# EAGLE design control (EAGLE 9.6.1)
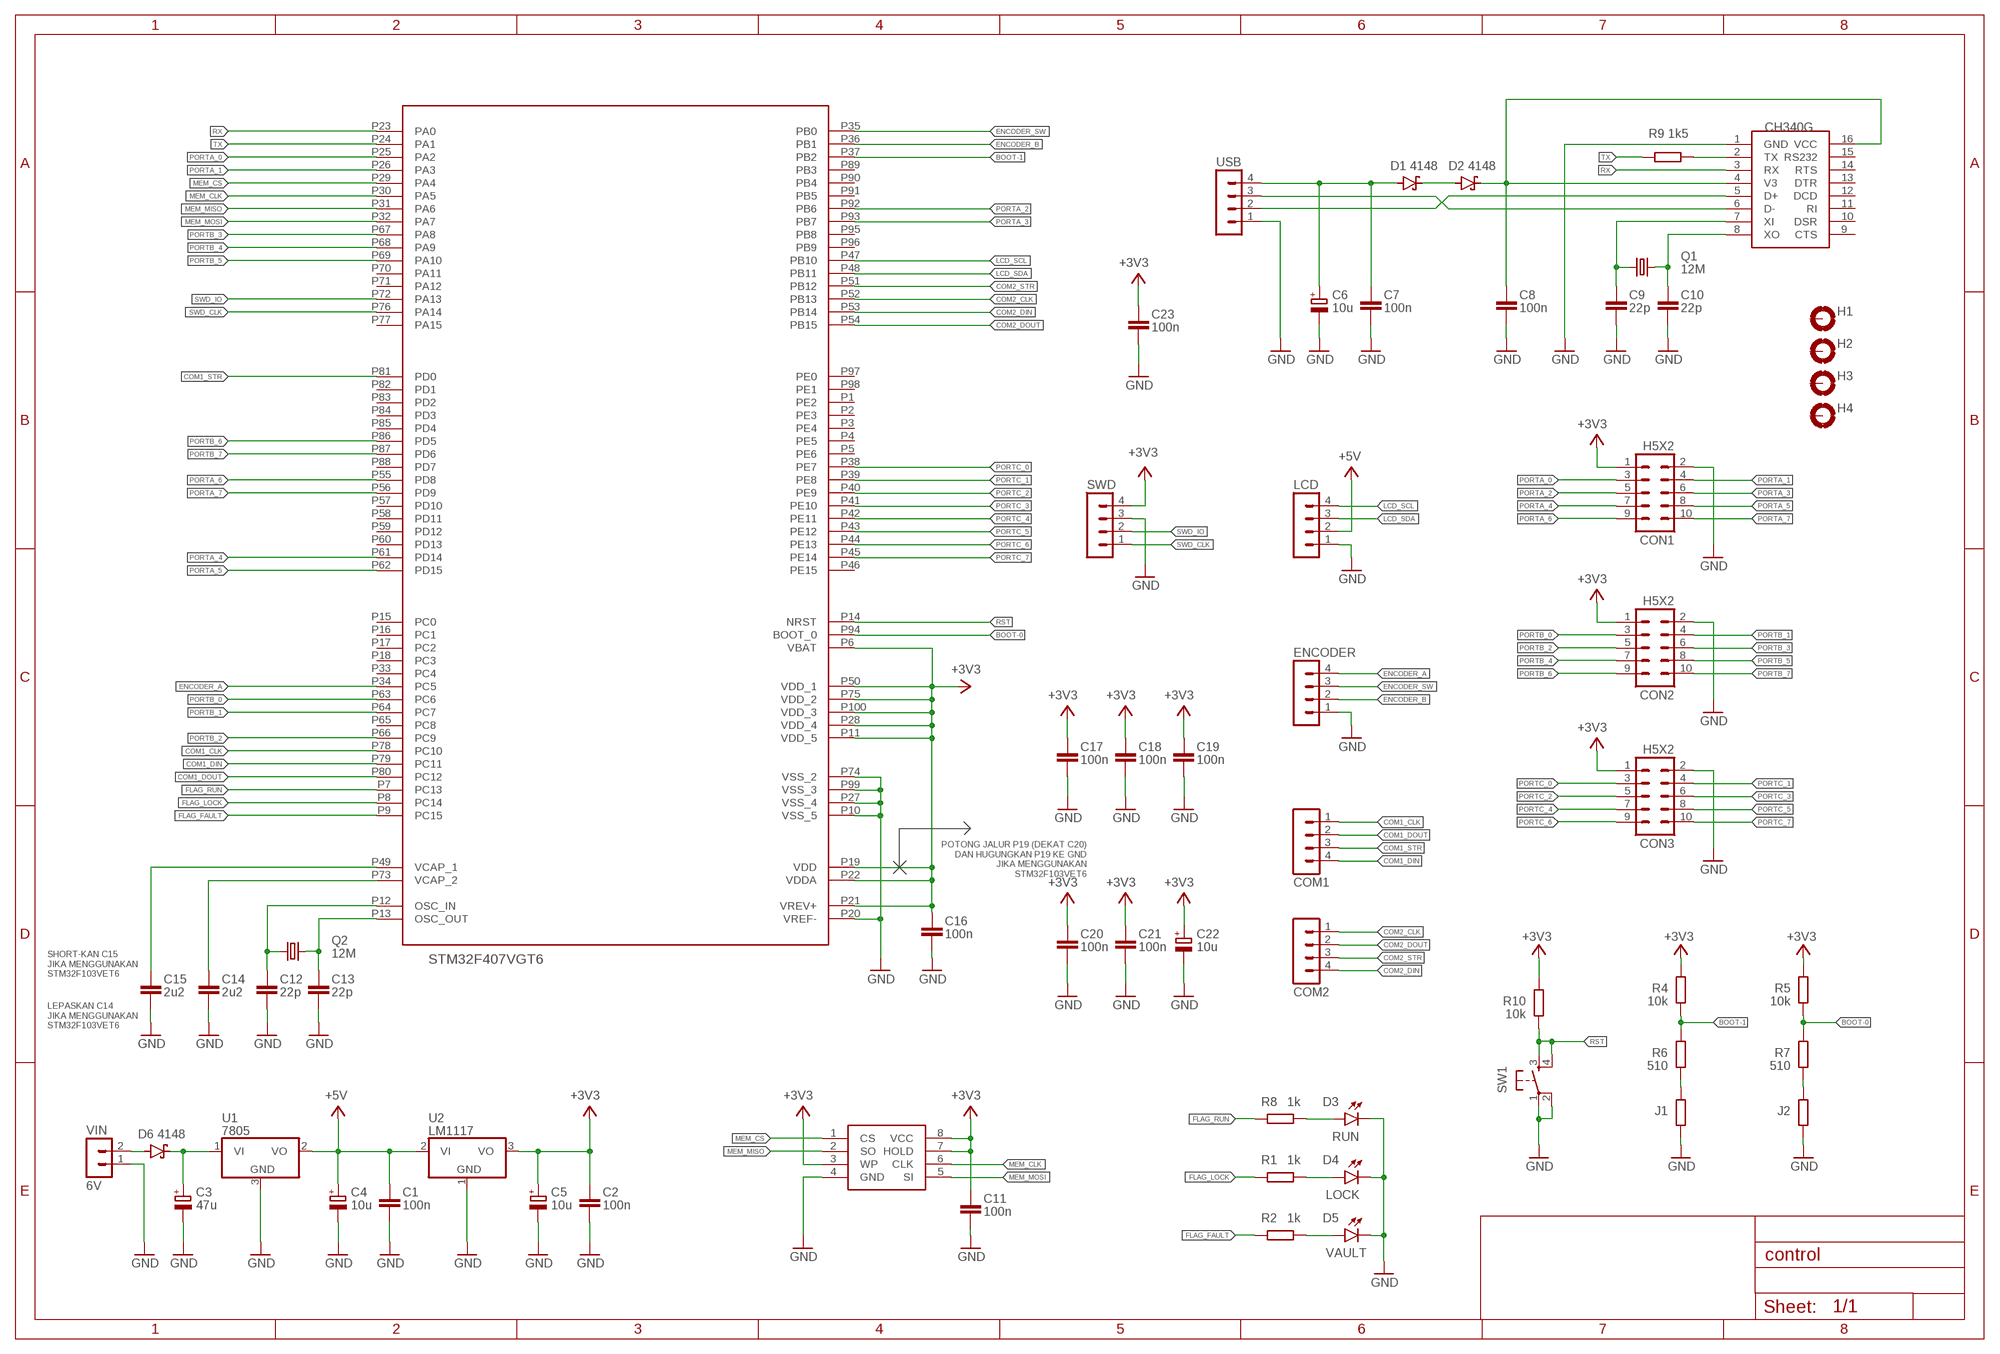
[diagram p0: schematic, sheet 1]

## Parts
C1  100n  CAP  [0805]
C2  100n  CAP  [0805]
C3  47u  C10UF  [E2,5-5]
C4  10u  C10UF  [E2,5-5]
C5  10u  C10UF  [E2,5-5]
C6  10u  C10UF  [E2,5-5]
C7  100n  CAP  [0805]
C8  100n  CAP  [0805]
C9  22p  CAP  [0805]
C10  22p  CAP  [0805]
C11  100n  CAP  [0805]
C12  22p  CAP  [0805]
C13  22p  CAP  [0805]
C14  2u2  CAP  [0805]
C15  2u2  CAP  [0805]
C16  100n  CAP  [0805]
C17  100n  CAP  [0805]
C18  100n  CAP  [0805]
C19  100n  CAP  [0805]
C20  100n  CAP  [0805]
C21  100n  CAP  [0805]
C22  10u  C10UF  [E2,5-5]
C23  100n  CAP  [0805]
COM1  MOLEX-4  [6410-04]
COM2  MOLEX-4  [6410-04]
CON1  H5X2  [MA05-2]
CON2  H5X2  [MA05-2]
CON3  H5X2  [MA05-2]
D1  4148  1N5817  [DO35Z7]
D2  4148  1N5817  [DO35Z7]
D3  RUN  LED3MM  [LED3MM]
D4  LOCK  LED3MM  [LED3MM]
D5  VAULT  LED3MM  [LED3MM]
D6  4148  1N5817  [DO35Z7]
ENCODER  MOLEX-4  [6410-04]
H1  MOUNT-PAD-ROUND3.0  [3,0-PAD]
H2  MOUNT-PAD-ROUND3.0  [3,0-PAD]
H3  MOUNT-PAD-ROUND3.0  [3,0-PAD]
H4  MOUNT-PAD-ROUND3.0  [3,0-PAD]
J1  10k  RES  [0805]
J2  10k  RES  [0805]
LCD  MOLEX-4  [6410-04]
Q1  12M  CRYSTAL  [HC49/S]
Q2  12M  CRYSTAL  [HC49/S]
R1  1k  RES  [0805]
R2  1k  RES  [0805]
R4  10k  RES  [0805]
R5  10k  RES  [0805]
R6  510  RES  [0805]
R7  510  RES  [0805]
R8  1k  RES  [0805]
R9  1k5  R025  [0204/7]
R10  10k  RES  [0805]
SW1  SW  [B3F-10XX]
SWD  MOLEX-4  [6410-04]
U1  7805  [TO252]
U2  LM1117  [TO252]
U3  W25QXX  [SOP8]
U4  STM32F407  [LQFP100]
U$1  CH340G  [SOIC16]
USB  MOLEX-4  [6410-04]
VIN  6V  MOLEX-2  [6410-02]

## Nets
+3V3: C2.P$1 C5.+ C11.P$1 C16.P$1 C17.P$1 C18.P$1 C19.P$1 C20.P$1 C21.P$1 C22.+ C23.P$1 CON1.1 CON2.1 CON3.1 R4.P$2 R5.P$2 R10.P$2 SWD.4 U2.3(VO) U3.3(WP) U3.7(HOLD) U3.8(VCC) U4.P6(VBAT) U4.P11(VDD_5) U4.P19(VDD) U4.P21(VREV+) U4.P22(VDDA) U4.P28(VDD_4) U4.P50(VDD_1) U4.P75(VDD_2) U4.P100(VDD_3)
+5V: C1.P$1 C4.+ LCD.2 U1.2(VO) U2.2(VI)
BOOT-0: R5.P$1 R7.P$2 U4.P94(BOOT_0)
BOOT-1: R4.P$1 R6.P$2 U4.P37(PB2)
COM1_CLK: COM1.1 U4.P78(PC10)
COM1_DIN: COM1.4 U4.P79(PC11)
COM1_DOUT: COM1.2 U4.P80(PC12)
COM1_STR: COM1.3 U4.P81(PD0)
COM2_CLK: COM2.1 U4.P52(PB13)
COM2_DIN: COM2.4 U4.P53(PB14)
COM2_DOUT: COM2.2 U4.P54(PB15)
COM2_STR: COM2.3 U4.P51(PB12)
ENCODER_A: ENCODER.4 U4.P34(PC5)
ENCODER_B: ENCODER.2 U4.P36(PB1)
ENCODER_SW: ENCODER.3 U4.P35(PB0)
FLAG_FAULT: R2.P$2 U4.P9(PC15)
FLAG_LOCK: R1.P$2 U4.P8(PC14)
FLAG_RUN: R8.P$2 U4.P7(PC13)
GND: C1.P$2 C2.P$2 C3.- C4.- C5.- C6.- C7.P$2 C8.P$2 C9.P$2 C10.P$2 C11.P$2 C12.P$2 C13.P$2 C14.P$2 C15.P$2 C16.P$2 C17.P$2 C18.P$2 C19.P$2 C20.P$2 C21.P$2 C22.- C23.P$2 CON1.2 CON2.2 CON3.2 D3.K(C) D4.K(C) D5.K(C) ENCODER.1 J1.P$1 J2.P$1 LCD.1 SW1.1(P) SW1.2(P1) SWD.3 U1.3(GND) U2.1(GND) U3.4(GND) U4.P10(VSS_5) U4.P20(VREF-) U4.P27(VSS_4) U4.P74(VSS_2) U4.P99(VSS_3) U$1.1(GND) USB.1 VIN.1
LCD_SCL: LCD.4 U4.P47(PB10)
LCD_SDA: LCD.3 U4.P48(PB11)
MEM_CLK: U3.6(CLK) U4.P30(PA5)
MEM_CS: U3.1(CS) U4.P29(PA4)
MEM_MISO: U3.2(SO) U4.P31(PA6)
MEM_MOSI: U3.5(SI) U4.P32(PA7)
N$1: C3.+ D6.C U1.1(VI)
N$2: C6.+ C7.P$1 D1.A USB.4
N$3: D1.C D2.A
N$4: C8.P$1 D2.C U$1.4(V3) U$1.16(VCC)
N$5: U$1.6(D-) USB.3
N$6: U$1.5(D+) USB.2
N$7: C9.P$1 Q1.1 U$1.7(XI)
N$8: C10.P$1 Q1.2 U$1.8(XO)
N$9: D5.A R2.P$1
N$10: D4.A R1.P$1
N$11: D3.A R8.P$1
N$12: C12.P$1 Q2.1 U4.P12(OSC_IN)
N$13: C13.P$1 Q2.2 U4.P13(OSC_OUT)
N$14: C14.P$1 U4.P73(VCAP_2)
N$15: C15.P$1 U4.P49(VCAP_1)
N$16: D6.A VIN.2
N$17: J1.P$2 R6.P$1
N$18: J2.P$2 R7.P$1
N$19: R9.2 U$1.2(TX)
PORTA_0: CON1.3 U4.P25(PA2)
PORTA_1: CON1.4 U4.P26(PA3)
PORTA_2: CON1.5 U4.P92(PB6)
PORTA_3: CON1.6 U4.P93(PB7)
PORTA_4: CON1.7 U4.P61(PD14)
PORTA_5: CON1.8 U4.P62(PD15)
PORTA_6: CON1.9 U4.P55(PD8)
PORTA_7: CON1.10 U4.P56(PD9)
PORTB_0: CON2.3 U4.P63(PC6)
PORTB_1: CON2.4 U4.P64(PC7)
PORTB_2: CON2.5 U4.P66(PC9)
PORTB_3: CON2.6 U4.P67(PA8)
PORTB_4: CON2.7 U4.P68(PA9)
PORTB_5: CON2.8 U4.P69(PA10)
PORTB_6: CON2.9 U4.P86(PD5)
PORTB_7: CON2.10 U4.P87(PD6)
PORTC_0: CON3.3 U4.P38(PE7)
PORTC_1: CON3.4 U4.P39(PE8)
PORTC_2: CON3.5 U4.P40(PE9)
PORTC_3: CON3.6 U4.P41(PE10)
PORTC_4: CON3.7 U4.P42(PE11)
PORTC_5: CON3.8 U4.P43(PE12)
PORTC_6: CON3.9 U4.P44(PE13)
PORTC_7: CON3.10 U4.P45(PE14)
RST: R10.P$1 SW1.3(S) SW1.4(S1) U4.P14(NRST)
RX: U4.P23(PA0) U$1.3(RX)
SWD_CLK: SWD.1 U4.P76(PA14)
SWD_IO: SWD.2 U4.P72(PA13)
TX: R9.1 U4.P24(PA1)
Unconnected: H1.B3,0(MOUNT) H2.B3,0(MOUNT) H3.B3,0(MOUNT) H4.B3,0(MOUNT) U4.P1(PE2) U4.P2(PE3) U4.P3(PE4) U4.P4(PE5) U4.P5(PE6) U4.P15(PC0) U4.P16(PC1) U4.P17(PC2) U4.P18(PC3) U4.P33(PC4) U4.P46(PE15) U4.P57(PD10) U4.P58(PD11) U4.P59(PD12) U4.P60(PD13) U4.P65(PC8) U4.P70(PA11) U4.P71(PA12) U4.P77(PA15) U4.P82(PD1) U4.P83(PD2) U4.P84(PD3) U4.P85(PD4) U4.P88(PD7) U4.P89(PB3) U4.P90(PB4) U4.P91(PB5) U4.P95(PB8) U4.P96(PB9) U4.P97(PE0) U4.P98(PE1) U$1.9(CTS) U$1.10(DSR) U$1.11(RI) U$1.12(DCD) U$1.13(DTR) U$1.14(RTS) U$1.15(RS232)

## Notes on the sheet
- POTONG JALUR P19 (DEKAT C20)
  DAN HUGUNGKAN P19 KE GND
  JIKA MENGGUNAKAN
  STM32F103VET6
- SHORT-KAN C15
  JIKA MENGGUNAKAN
  STM32F103VET6
- STM32F407VGT6
- LEPASKAN C14
  JIKA MENGGUNAKAN
  STM32F103VET6

## Library data of the parts
C1 C2 C7-C21 C23 = RL-smd:CAP
C3-C6 C22 = standart:C10UF
COM1 COM2 ENCODER LCD SWD USB = molex-header:MOLEX-4
CON1-CON3 = molex-header:H5X2
D1 D2 D6 = standart:1N5817
D3-D5 = komponenku:LED3MM
H1-H4 = holes:MOUNT-PAD-ROUND: MOUNTING PAD, round
J1 J2 R1 R2 R4-R8 R10 = RL-smd:RES
Q1 Q2 = cystal:CRYSTAL
R9 = standart:R025
SW1 = enc - sw:SW
U1 = dt-regulator:7805
U2 = dt-regulator:LM1117
U3 = w28qxx:W25QXX
U4 = stm32f407:STM32F407
U$1 = ch340g:CH340G
VIN = molex-header:MOLEX-2

## Board
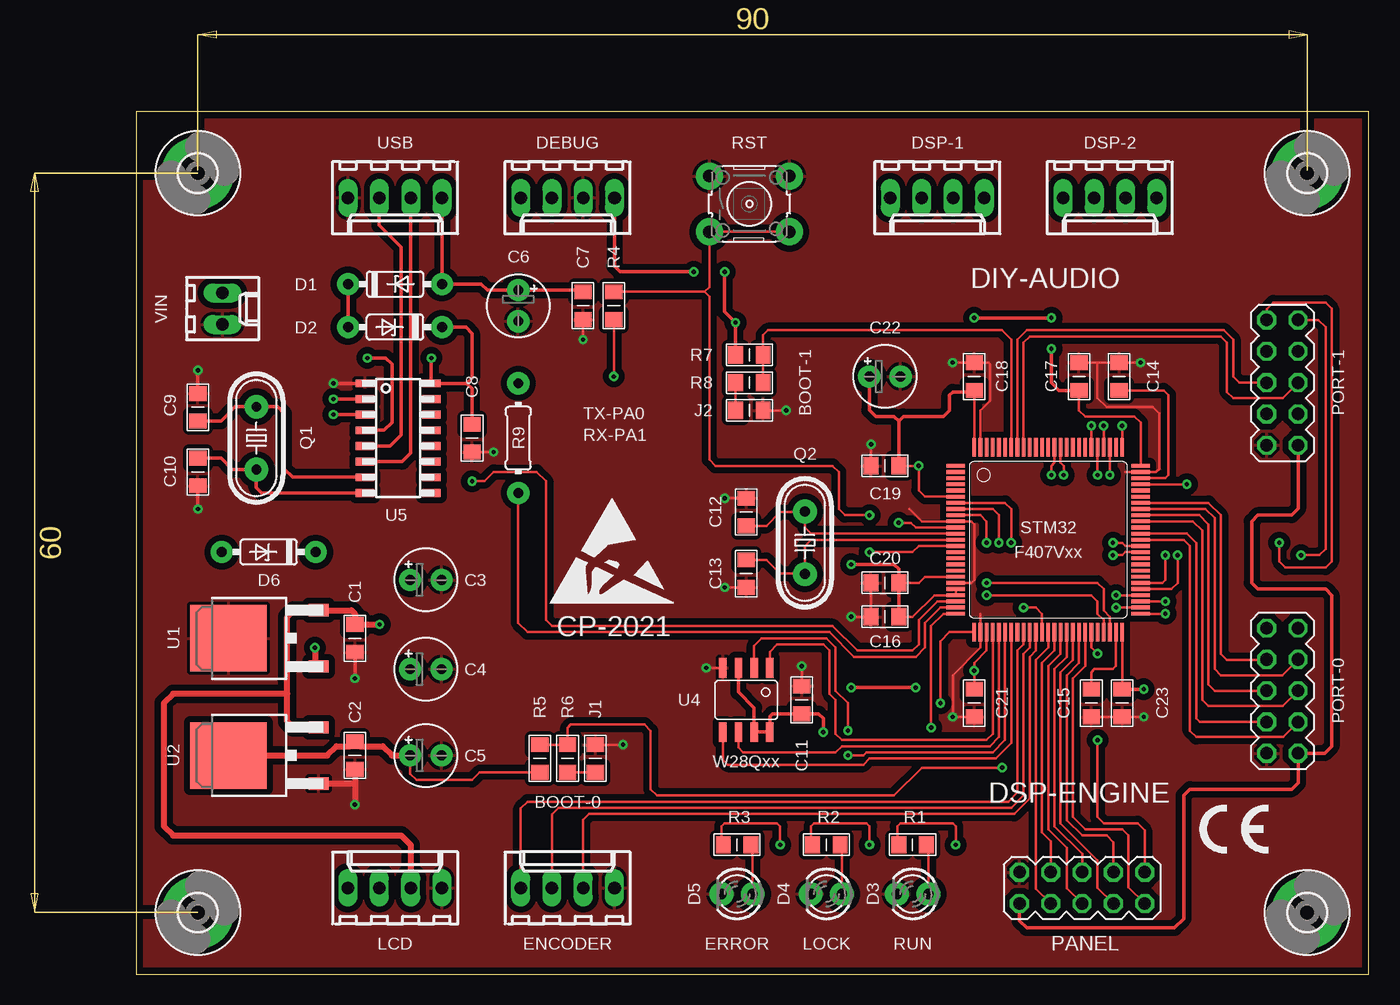
[diagram p1: board, top side]
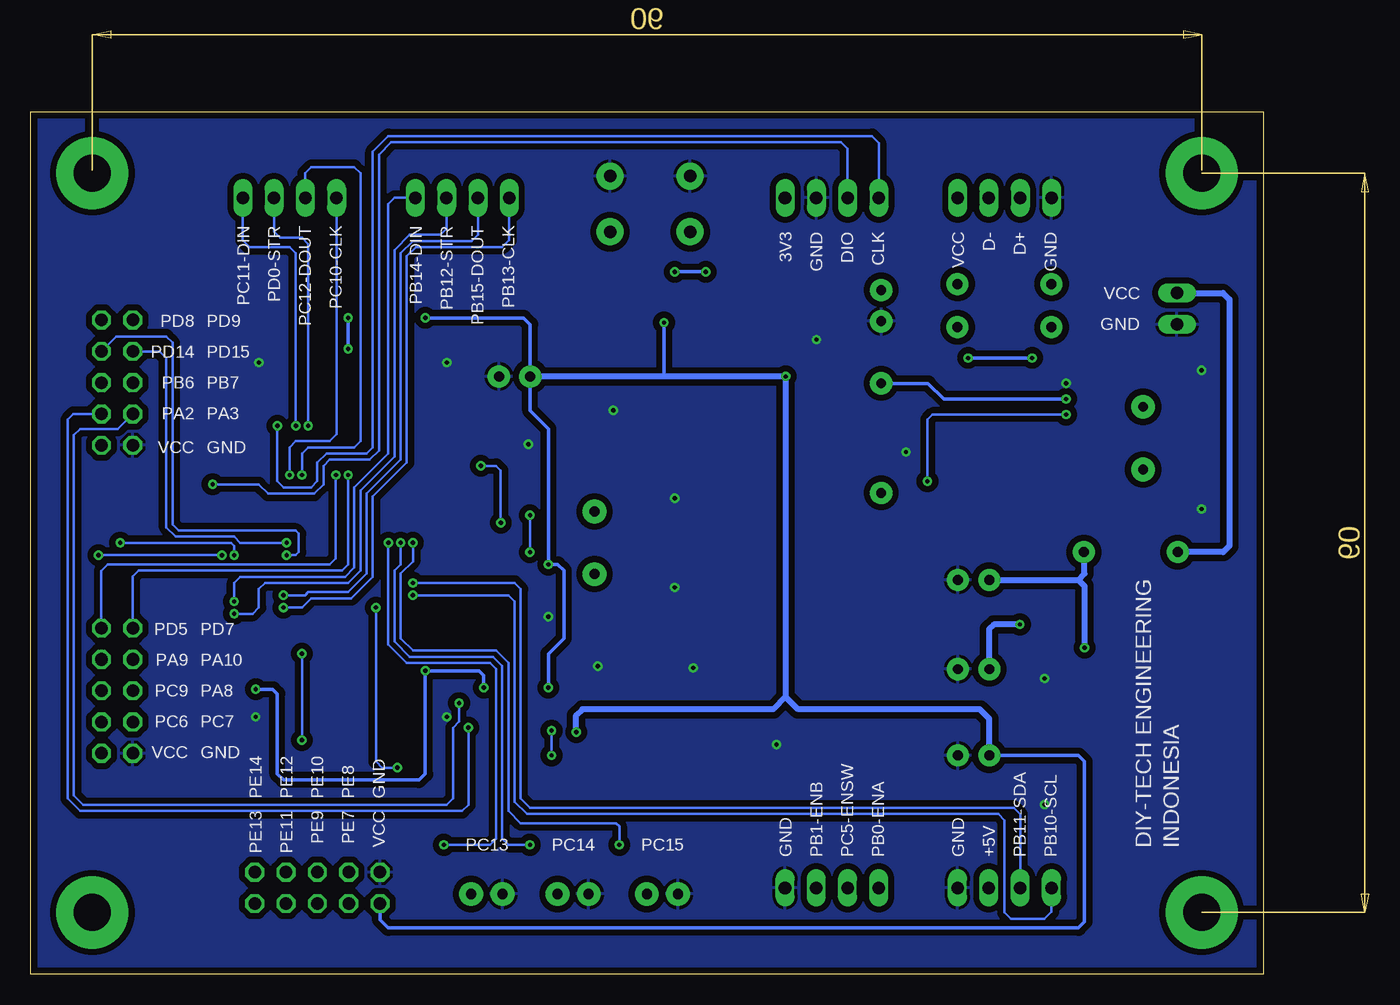
[diagram p2: board, bottom side, seen from below]

Size 100 x 70 mm. Coordinates in mm from the lower left corner, seen from the top.
Outline: 0,0 100,0 100,70 0,70 0,0
Copper layers (1*16): Top 0.035mm / dielectric 1.5mm / Bottom 0.035mm
Design rules "default *": minimum track width 6mil, minimum drill 0.35mm, track to track 6mil, track to pad 6mil, pad to pad 6mil, via to via 6mil, smd to smd 6mil, copper to edge 0.5mm, drill to drill 6mil, minimum pad ring 10mil, minimum via ring 8mil, stop-mask expansion 4mil, vias tented up to drill 0.35mm, thermal gap 10mil

### Footprints (pad centres in the part's own frame; a part is rotated, then mirrored left to right if it is on the bottom)
0805 = smd 1.2 x 1.4: P$1 -1.125,0; P$2 1.125,0
E2,5-5 = drill 0.8 pad 1.8: + -1.27,0; - 1.27,0
6410-04 = drill 1.016 long: 1 3.81,0; 2 1.27,0; 3 -1.27,0; 4 -3.81,0
MA05-2 = drill 1.016 octagon: 1 -5.08,-1.27; 2 -5.08,1.27; 3 -2.54,-1.27; 4 -2.54,1.27; 5 0,-1.27; 6 0,1.27; 7 2.54,-1.27; 8 2.54,1.27; 9 5.08,-1.27; 10 5.08,1.27
DO35Z7 = drill 0.8 pad 1.8: A 3.81,0; C -3.81,0
LED3MM = drill 0.813 pad 1.93: A -1.27,0; K 1.27,0
3,0-PAD = drill 3 pad 5.842: B3,0 0,0
HC49/S = drill 0.8 pad 1.93: 1 -2.54,0; 2 2.54,0
0204/7 = drill 0.8 pad 1.8: 1 -4.445,0; 2 4.445,0
B3F-10XX = drill 1.016 pad 2.184: 1 -3.251,2.261; 2 3.251,2.261; 3 -3.251,-2.261; 4 3.251,-2.261
TO252 = smd 1 x 1.6: 1 -2.28,-4.8; 2 2.28,-4.8 | smd 5.4 x 6.2: 3 0,2.5
SOP8 = smd 0.6 x 1.6: 1 -1.905,-2.6; 2 -0.635,-2.6; 3 0.635,-2.6; 4 1.905,-2.6; 5 1.905,2.6; 6 0.635,2.6; 7 -0.635,2.6; 8 -1.905,2.6
LQFP100 = smd 1.5 x 0.3: P1 -7.5,6; P2 -7.5,5.5; P3 -7.5,5; P4 -7.5,4.5; P5 -7.5,4; P6 -7.5,3.5; P7 -7.5,3; P8 -7.5,2.5; P9 -7.5,2; P10 -7.5,1.5; P11 -7.5,1; P12 -7.5,0.5; P13 -7.5,0; P14 -7.5,-0.5; P15 -7.5,-1; P16 -7.5,-1.5; P17 -7.5,-2; P18 -7.5,-2.5; P19 -7.5,-3; P20 -7.5,-3.5; P21 -7.5,-4; P22 -7.5,-4.5; P23 -7.5,-5; P24 -7.5,-5.5; P25 -7.5,-6; P51 7.5,-6; P52 7.5,-5.5; P53 7.5,-5; P54 7.5,-4.5; P55 7.5,-4; P56 7.5,-3.5; P57 7.5,-3; P58 7.5,-2.5; P59 7.5,-2; P60 7.5,-1.5; P61 7.5,-1; P62 7.5,-0.5; P63 7.5,0; P64 7.5,0.5; P65 7.5,1; P66 7.5,1.5; P67 7.5,2; P68 7.5,2.5; P69 7.5,3; P70 7.5,3.5; P71 7.5,4; P72 7.5,4.5; P73 7.5,5; P74 7.5,5.5; P75 7.5,6 | smd 0.3 x 1.5: P26 -6,-7.5; P27 -5.5,-7.5; P28 -5,-7.5; P29 -4.5,-7.5; P30 -4,-7.5; P31 -3.5,-7.5; P32 -3,-7.5; P33 -2.5,-7.5; P34 -2,-7.5; P35 -1.5,-7.5; P36 -1,-7.5; P37 -0.5,-7.5; P38 0,-7.5; P39 0.5,-7.5; P40 1,-7.5; P41 1.5,-7.5; P42 2,-7.5; P43 2.5,-7.5; P44 3,-7.5; P45 3.5,-7.5; P46 4,-7.5; P47 4.5,-7.5; P48 5,-7.5; P49 5.5,-7.5; P50 6,-7.5; P76 6,7.5; P77 5.5,7.5; P78 5,7.5; P79 4.5,7.5; P80 4,7.5; P81 3.5,7.5; P82 3,7.5; P83 2.5,7.5; P84 2,7.5; P85 1.5,7.5; P86 1,7.5; P87 0.5,7.5; P88 0,7.5; P89 -0.5,7.5; P90 -1,7.5; P91 -1.5,7.5; P92 -2,7.5; P93 -2.5,7.5; P94 -3,7.5; P95 -3.5,7.5; P96 -4,7.5; P97 -4.5,7.5; P98 -5,7.5; P99 -5.5,7.5; P100 -6,7.5
SOIC16 = smd 0.635 x 1.524: 1 -4.445,-2.695; 2 -3.175,-2.695; 3 -1.905,-2.695; 4 -0.635,-2.695; 5 0.635,-2.695; 6 1.905,-2.695; 7 3.175,-2.695; 8 4.445,-2.695; 9 4.445,2.695; 10 3.175,2.695; 11 1.905,2.695; 12 0.635,2.695; 13 -0.635,2.695; 14 -1.905,2.695; 15 -3.175,2.695; 16 -4.445,2.695
6410-02 = drill 1.016 long: 1 1.27,0; 2 -1.27,0

### Placement (x,y rotation side)
C1  17.75,27.25 270 top
C2  17.75,17.75 270 top
C3  23.5,32 0 top
C4  23.5,24.75 0 top
C5  23.5,17.75 0 top
C6  31,54.25 270 top
C7  36.25,54.25 270 top
C8  27.25,43.5 270 top
C9  5,46 90 top
C10  5,40.75 270 top
C11  80,22 270 top
C12  49.5,37.5 90 top
C13  49.5,32.5 270 top
C14  79.75,48.5 90 top
C15  77.5,22 270 top
C16  60.75,41.25 180 top
C17  54,22.25 90 top
C18  76.5,48.5 90 top
C19  68,22 270 top
C20  60.75,29 180 top
C21  68,48.5 90 top
C22  60.75,48.5 0 top
C23  60.75,31.75 180 top
COM1  79,63 180 top
COM2  65,63 180 top
CON1  93,48 90 top
CON2  93,23 90 top
CON3  76.75,7 0 top
D1  21,56 0 top
D2  21,52.5 180 top
D3  63,6.5 180 top
D4  56,6.5 180 top
D5  48.75,6.5 180 top
D6  10.75,34.25 180 top
E$1  [ESD_10.00]  33.5,30 0 top
ENCODER  35,7 0 top
H1  95,5 0 top
H2  5,65 0 top
H3  95,65 0 top
H4  5,5 0 top
J1  37.25,17.5 270 top
J2  49.75,45.75 180 top
LCD  21,7 0 top
Q1  9.75,43.5 270 top
Q2  54.25,35 270 top
R1  56,10.5 180 top
R2  48.75,10.5 180 top
R4  32.75,17.5 270 top
R5  49.75,50.25 180 top
R6  35,17.5 90 top
R7  49.75,48 0 top
R8  63,10.5 180 top
R9  31,43.5 90 top
R10  38.75,54.25 270 top
SW1  49.75,62.5 0 top
SWD  35,63 180 top
U1  10,27.25 90 top
U2  10,17.75 90 top
U3  49.5,22.25 180 top
U4  74,35.25 0 top
U$1  21.25,43.5 270 top
U$2  [CE-4MM]  86.25,9.75 0 top
USB  21,63 180 top
VIN  7,54 270 top

### Tracks (layer width: path | path; a pad name or v marks a point on that pad's centre or on a via)
+3V3  (via drill 0.35)
  Top 0.2: U4.P28 69,26.25 68,25.25 v68,24.62 C19.P$1 | U4.P50 C11.P$1 | U4.P21 U4.P22 64.75,30.75 63,29 C20.P$1 62,28.88 | C23.P$1 63.5,31.75 64,32.25 U4.P19 | C21.P$1 68,47.25 U4.P100 | U4.P75 81.5,44.75 81,45.25 77,45.25 76.5,45.75 C18.P$1 | 48.87,22.89 48.87,23 | 48.87,24.75 U3.3 | R10.P$2 v38.75,48.5 | R4.P$2 27.88,16.38 27.25,15.75 22.75,15.75 22.23,16.27 C5.+ | v61.88,36.62 62.88,36.62 63.25,36.25 U4.P11 | C16.P$1 v63.5,41.25 63.5,39.25 64,38.75 U4.P6
  Top 0.3: C22.+ 59.48,45.77 60,45.25 61.5,45.25 61.88,44.88 | 61.88,44.88 62.25,45.25 65.5,45.25 66,45.75 66,47 66.25,47.25 68,47.25 | 61.88,44.88 C16.P$1 | v58,33.25 61.5,33.25 61.88,32.88 C23.P$1 C20.P$1 | C19.P$1 67.88,23.25 | C18.P$1 74.88,47.38 74.25,48 v74.25,50.75 | v68,53.25 v74.25,53.25 | C11.P$1 v81.75,23.12 | v63.25,23.25 v58,23.25 | CON3.1 71.67,4.33 72.25,3.75 84.25,3.75 85,4.5 85,14.5 85.5,15 93.75,15 94.27,15.52 CON2.1 96.42,17.92 97,18.5 97,30.75 96.5,31.25 91,31.25 90.5,31.75 90.5,36.75 91,37.25 93.75,37.25 94.27,37.77 CON1.1 | SWD.4 38.81,57.44 39.25,57 v45.25,57 | v47.75,57 47.75,53.75 v48.62,52.88 R5.P$2 | v55.75,19.65 55.75,20.75 55.38,21.12 C17.P$1 51.62,21.12 51.41,20.91 U3.8 U3.7 50.13,21.61 48.87,22.89 | 48.87,23 48.87,24.75
  Top 0.5: U2.3 15.5,17.75 16.25,18.5 17.38,18.5 C2.P$1 18.12,18.5 20,18.5 20.75,17.75 C5.+
  Bottom 0.2: v63.5,41.25 62.25,41.25 61.88,40.88 v61.88,36.62
  Bottom 0.3: v74.25,50.75 v74.25,53.25 | v68,53.25 60,53.25 59.48,52.73 C22.+ 59.48,45.73 58,44.25 v58,33.25 57.25,33.25 56.75,32.75 56.75,27.25 58,26 v58,23.25 | v81.75,23.12 80.38,23.12 80,22.75 80,16.25 79.5,15.75 68.5,15.75 68,16.25 v68,24.62 63.62,24.62 63.25,24.25 v63.25,23.25 | C5.+ 15,17.75 14.5,17.25 14.5,4.25 15,3.75 71,3.75 71.67,4.42 CON3.1 | v47.75,57 v45.25,57 | v48.62,52.88 48.62,48.62 48.75,48.5
  Bottom 0.5: C5.+ 22.23,20.73 23,21.5 37.75,21.5 38.75,22.5 | 38.75,22.5 v38.75,48.5 48.75,48.5 C22.+ | 38.75,22.5 39.75,21.5 55.25,21.5 55.75,21 v55.75,19.65
+5V  (via drill 0.35)
  Top 0.5: v19.75,28.38 C1.P$1 17.75,29.25 17.47,29.53 U1.2 12.78,29.53 12.25,29 12.25,22.75 | U2.2 12.72,20.03 12.25,20.5 12.25,22.75 | 12.25,22.75 3,22.75 2.25,22 2.25,12 3,11.25 21.5,11.25 22.27,10.48 LCD.2
  Bottom 0.5: v19.75,28.38 21.88,28.38 22.25,28 22.25,24.77 C4.+
BOOT-0
  Top 0.2: R7.P$2 R5.P$1 50.88,51.88 51.25,52.25 70.25,52.25 71,51.5 U4.P94
BOOT-1  (via drill 0.35)
  Top 0.2: R4.P$1 R6.P$2 35,20 35.25,20.25 41.25,20.25 41.75,19.75 41.75,15 42.25,14.5 61.5,14.5 63.75,16.75 v70.25,16.75 | v72,29.75 73,29.75 73.5,29.25 U4.P37
  Bottom 0.2: v72,29.75 72,17.25 71.5,16.75 v70.25,16.75
COM1_CLK  (via drill 0.35)
  Top 0.2: U4.P78 v79,40.5
  Bottom 0.2: v79,40.5 U4.P78 78.5,43.25 75.75,43.25 75.19,43.81 COM1.1
COM1_DIN  (via drill 0.35)
  Top 0.2: U4.P79 v78.5,44.5
  Bottom 0.2: COM1.4 82.81,59.56 82.25,59 79,59 78.5,58.5 v78.5,44.5
COM1_DOUT  (via drill 0.35)
  Top 0.2: U4.P80 v78,40.5
  Bottom 0.2: v78,40.5 78,42.25 77.5,42.75 73.75,42.75 73.25,43.25 73.25,65 73.75,65.5 77.25,65.5 77.75,65 77.75,63.02 COM1.2
COM1_STR  (via drill 0.35)
  Top 0.2: U4.P81 v77.5,44.5
  Bottom 0.2: v77.5,44.5 77.5,59.25 78,59.75 79.75,59.75 80.27,60.27 COM1.3
COM2_CLK  (via drill 0.35)
  Top 0.2: U4.P52 v79.5,29.75
  Bottom 0.2: v79.5,29.75 78,29.75 77.25,30.5 74,30.5 72.25,32.25 72.25,38.75 69.5,41.5 69.5,58.25 68.75,59 61.75,59 61.19,59.56 COM2.1
COM2_DIN  (via drill 0.35)
  Top 0.2: U4.P53 v83.5,30.25
  Bottom 0.2: v83.5,30.25 83.5,31.75 83,32.25 74.5,32.25 73.75,33 73.75,39.5 71,42.25 71,62.5 70.5,63 COM2.4
COM2_DOUT  (via drill 0.35)
  Top 0.2: U4.P54 v79.5,30.75
  Bottom 0.2: v79.5,30.75 77.75,30.75 77.5,31 74.25,31 72.75,32.5 72.75,39 70,41.75 70,58.5 69,59.5 64.25,59.5 63.73,60.02 COM2.2
COM2_STR  (via drill 0.35)
  Top 0.2: U4.P51 v83.5,29.25
  Bottom 0.2: v83.5,29.25 82,29.25 81.5,29.75 81.5,31.25 81,31.75 74.25,31.75 73.25,32.75 73.25,39.25 70.5,42 70.5,58.75 69.25,60 66.75,60 66.25,60.5 66.25,62.98 COM2.3
ENCODER_A
  Top 0.2: U4.P34 72,26.75 71.5,26.25 71.5,14.75 70.75,14 31.75,14 31.19,13.44 ENCODER.4
ENCODER_B
  Top 0.2: U4.P36 73,26.25 72.5,25.75 72.5,14.25 71.25,13 36.75,13 36.27,12.52 ENCODER.2
ENCODER_SW
  Top 0.2: U4.P35 72.5,26.5 72,26 72,14.5 71,13.5 34.25,13.5 33.73,12.98 ENCODER.3
FLAG_FAULT  (via drill 0.35)
  Top 0.2: U4.P9 68.5,37.25 69,36.75 v69,35 | v52.25,10.5 52.25,12 52,12.25 47.75,12.25 47.5,12 47.5,10.62 R2.P$2
  Bottom 0.2: v69,35 69,33.5 70,32.5 70,27.25 69,26.25 62.25,26.25 61.25,25.25 61.25,13.25 60.25,12.25 52.5,12.25 52.25,12 v52.25,10.5
FLAG_LOCK  (via drill 0.35)
  Top 0.2: v70,35 70,37.25 69.5,37.75 U4.P8 | v59.5,10.5 59.5,12 59.25,12.25 55,12.25 54.75,12 54.75,10.62 R1.P$2
  Bottom 0.2: v70,35 70,33.25 70.5,32.75 70.5,27 69.25,25.75 62.5,25.75 61.75,25 61.75,11 61.25,10.5 v59.5,10.5
FLAG_RUN  (via drill 0.35)
  Top 0.2: v71,35 71,37.75 70.5,38.25 U4.P7 | v66.5,10.5 66.5,12 66.25,12.25 62,12.25 61.75,12 61.75,10.62 R8.P$2
  Bottom 0.2: v71,35 71,26.75 69.5,25.25 62.75,25.25 62.25,24.75 62.25,11 62.75,10.5 v66.5,10.5
GND  (via drill 0.35)
  Top 0.2: U3.4 v46.25,24.85 | C17.P$2 v54,25 | C15.P$2 C11.P$2 v81.75,20.88 | C19.P$2 v66.25,20.88 66.25,24.25 68.5,26.5 U4.P27 68.5,29.25 | C23.P$2 C20.P$2 v58,29 | C13.P$2 v47.75,31.38 | C12.P$2 v47.75,38.62 | C16.P$2 v59.62,43 | 78,49.62 C14.P$2 v81.5,49.62 | 78,49.62 C18.P$2 | v66.25,49.62 C21.P$2 69.12,49.62 69.25,49.5 69.25,46.5 68.5,45.75 U4.P99 | C8.P$2 v29,42.38 | C7.P$2 v36.25,51.5 | J1.P$1 v39.5,18.62 | J2.P$1 v52.75,45.75 | 62.75,37.75 63.75,36.75 U4.P10 67.75,36.75 68,36.5 68,32 67.75,31.75 U4.P20 | 78,49.62 78,46.75 78.75,46 82.5,46 83,45.5 83,41 82.75,40.75 U4.P74 80.25,40.75
  Top 0.3: U$1.1 v16,47.95 | C9.P$2 v5,49 | C10.P$2 v5,37.75 | C1.P$2 v17.75,24 | v17.75,13.75 17.75,15.5 C2.P$2
  Top 0.5: 8.25,26.5 U1.3 | U2.1 14.83,15.5 17.75,15.5 | C2.P$2 v17.75,13.75
  pour Bottom (isolate 0.5): 0,70 100,70 100,0 0,0
  pour Top (isolate 0.5): 0,70 100,70 100,0 0,0
LCD_SCL  (via drill 0.35)
  Top 0.2: U4.P47 78.5,28.75 78,29.25 78,30.25 77.5,30.75 v69,30.75 68.75,30.75
  Bottom 0.2: LCD.4 17.19,5.06 17.75,4.5 20.5,4.5 21,5 21,12.5 21.5,13 59.75,13 60.75,14 60.75,30.25 61.25,30.75 v69,30.75
LCD_SDA  (via drill 0.35)
  Top 0.2: U4.P48 79,29 78.5,29.5 78.5,31.25 78,31.75 v69,31.75
  Bottom 0.2: v69,31.75 60.75,31.75 60.25,31.25 60.25,14.25 59.5,13.5 20.25,13.5 19.73,12.98 LCD.3
MEM_CLK
  Top 0.2: U4.P30 70,19.25 69.25,18.5 57.25,18.5 56.75,18 49.25,18 48.87,18.39 U3.6
MEM_CS
  Top 0.2: U4.P29 69.5,19.5 69,19 57.25,19 56.75,19.5 56.75,22.25 56.25,22.75 56.25,26.25 55.75,26.75 52,26.75 51.41,26.16 U3.1
MEM_MISO  (via drill 0.35)
  Top 0.2: U4.P31 70.5,19 69.5,18 59.25,18 59,17.75 v57.75,17.75 | U3.2 50.13,26.64 50.75,27.25 56,27.25 56.75,26.5 56.75,23 57.75,22 v57.75,19.75
  Bottom 0.2: v57.75,19.75 v57.75,17.75
MEM_MOSI
  Top 0.2: U4.P32 71,18.75 69.75,17.5 59.5,17.5 59,17 48,17 47.59,17.41 U3.5
N$1  (via drill 0.35)
  Top 0.5: v14.5,26.5 14.5,25.27 U1.1
  Bottom 0.5: C3.+ 15,32 | 15,32 14.5,32.5 14.5,34.19 D6.C | 15,32 14.5,31.5 v14.5,26.5
N$2
  Top 0.3: USB.4 D1.A 28,56 28.5,55.5 30.98,55.5 C6.+ 36.1,55.52 C7.P$1
N$3
  Top 0.3: D1.C D2.A
N$4  (via drill 0.35)
  Top 0.3: v23.95,50 U$1.16 26.8,47.95 | U$1.4 20.14,44.13 20.75,44.75 20.75,49.5 20.25,50 v18.75,50 | C8.P$1 27.25,47.5 26.8,47.95 | D2.C 26.75,52.5 27.25,52 27.25,48.39 26.8,47.95
  Bottom 0.3: v23.95,50 v18.75,50
N$5
  Top 0.3: USB.3 22.27,42.27 21.59,41.59 U$1.6
N$6
  Top 0.3: USB.2 19.73,60.77 21.5,59 21.5,43.75 20.61,42.87 U$1.5
N$7
  Top 0.3: C9.P$1 6.88,44.88 8.04,46.04 Q1.1 11.46,46.04 12,45.5 12,41 12.68,40.33 U$1.7
N$8
  Top 0.3: C10.P$1 6.88,41.88 7.79,40.96 Q1.2 9.75,39.5 10.2,39.05 U$1.8
N$9
  Top 0.2: R2.P$1 50.02,10.36 D5.A
N$10
  Top 0.2: R1.P$1 57.27,10.36 D4.A
N$11
  Top 0.2: R8.P$1 64.27,10.36 D3.A
N$12
  Top 0.2: U4.P12 54.75,35.75 54.25,36.25 54.25,37.5 | 54.25,37.5 Q2.1 | 49.62,36.25 C12.P$1 51.12,36.38 52.25,37.5 54.25,37.5
N$13
  Top 0.2: U4.P13 54.75,35.25 54.25,34.75 54.25,32.5 | 54.25,32.5 Q2.2 | C13.P$1 51.12,33.62 52.25,32.5 54.25,32.5
N$14
  Top 0.2: C14.P$1 83.38,47.38 83.75,47 83.75,40.5 83.5,40.25 U4.P73
N$15
  Top 0.2: C15.P$1 77.5,24.5 77.75,24.75 79.25,24.75 79.5,25 U4.P49
N$16
  Bottom 0.5: VIN.2 3.27,55.27 2.75,54.75 2.75,34.75 3.25,34.25 D6.A
N$17
  Top 0.2: R6.P$1 J1.P$2
N$18
  Top 0.2: R7.P$1 J2.P$2
N$19  (via drill 0.35)
  Top 0.3: U$1.2 v16,46.67
  Bottom 0.3: v16,46.67 25.93,46.67 27.2,47.95 R9.2
PORTA_0  (via drill 0.35)
  Top 0.2: U4.P25 65.5,29.25 64.5,28.25 v64.5,20
  Bottom 0.2: CON1.3 96.54,45.46 97,45 97,14.25 96,13.25 65,13.25 64.5,13.75 v64.5,20
PORTA_1  (via drill 0.35)
  Top 0.2: U4.P26 66,27.75 65.25,27 v65.25,22
  Bottom 0.2: CON1.4 92.94,44.25 96,44.25 96.5,43.75 96.5,14.5 95.75,13.75 66.25,13.75 65.75,14.25 65.75,20 65.25,20.5 v65.25,22
PORTA_2
  Top 0.2: CON1.5 93.02,46.75 89,46.75 88.5,47.25 88.5,51.25 88,51.75 72.5,51.75 72,51.25 U4.P92
PORTA_3
  Top 0.2: U4.P93 71.5,51.5 72.25,52.25 88.25,52.25 89,51.5 89,48.5 89.5,48 CON1.6
PORTA_4  (via drill 0.35)
  Top 0.2: U4.P61 80.25,34.25 80,34 v79.25,34
  Bottom 0.2: v79.25,34 78.5,34 78.25,34.25 78.25,35.75 78.5,36 88,36 88.5,36.5 88.5,51.25 89,51.75 93.06,51.75 CON1.7
PORTA_5  (via drill 0.35)
  Top 0.2: U4.P62 80.25,34.75 80,35 v79.25,35
  Bottom 0.2: v79.25,35 83,35 83.5,35.5 88.25,35.5 89,36.25 89,50 89.54,50.54 CON1.8
PORTA_6  (via drill 0.35)
  Top 0.2: U4.P55 84,31.25 84.5,31.75 v84.5,34 | CON1.9 95.92,53.08 96.5,52.5 96.5,34.5 96,34 v94.5,34
  Bottom 0.2: 94.27,53.02 CON1.9 | v84.5,34 v94.5,34
PORTA_7  (via drill 0.35)
  Top 0.2: U4.P56 83.25,31.75 83.5,32 v83.5,34 | CON1.10 91.73,53.98 92.25,54.5 96.5,54.5 97,54 97,33.5 96.5,33 93.25,33 92.75,33.5 v92.75,35
  Bottom 0.2: v83.5,34 83.5,34.75 83.75,35 v92.75,35
PORTB_0
  Top 0.2: CON2.3 93.06,19.25 86,19.25 85.5,19.75 85.5,34.75 85,35.25 U4.P63
PORTB_1
  Top 0.2: CON2.4 86.29,20.46 86,20.75 86,35 85.25,35.75 U4.P64
PORTB_2
  Top 0.2: CON2.5 93.02,21.75 87,21.75 86.5,22.25 86.5,36 85.75,36.75 U4.P66
PORTB_3
  Top 0.2: U4.P67 86.25,37.25 87,36.5 87,23.5 87.5,23 CON2.6
PORTB_4
  Top 0.2: CON2.7 92.98,24.25 88,24.25 87.5,24.75 87.5,37 86.75,37.75 U4.P68
PORTB_5
  Top 0.2: U4.P69 87,38.25 88,37.25 88,26 88.5,25.5 91.69,25.5 CON2.8
PORTB_6  (via drill 0.35)
  Top 0.2: v75.25,40.5 75.25,41.25 75,41.5 U4.P86
  Bottom 0.2: v75.25,40.5 75.25,33.75 75.75,33.25 93.75,33.25 94.27,32.73 CON2.9
PORTB_7  (via drill 0.35)
  Top 0.2: U4.P87 74.5,41.5 74.25,41.25 v74.25,40.5
  Bottom 0.2: v74.25,40.5 74.25,33.25 74.75,32.75 91.25,32.75 91.73,32.27 CON2.10
PORTC_0
  Top 0.2: CON3.3 73,6.94 73,25.5 74,26.5 U4.P38
PORTC_1
  Top 0.2: U4.P39 74.5,26.25 73.5,25.25 73.5,11.5 74.21,10.79 CON3.4
PORTC_2
  Top 0.2: U4.P40 75,26 74,25 74,11.75 75.5,10.25 75.5,6.98 CON3.5
PORTC_3
  Top 0.2: CON3.6 76.75,9.75 74.5,12 74.5,24.75 75.5,25.75 U4.P41
PORTC_4
  Top 0.2: U4.P42 76,25.5 75,24.5 75,12.25 78,9.25 78,7.02 CON3.7
PORTC_5
  Top 0.2: U4.P43 76.5,25.25 75.5,24.25 75.5,12.5 76.75,11.25 78.75,11.25 79.29,10.71 CON3.8
PORTC_6
  Top 0.2: U4.P44 77,25 76,24 76,12.75 77,11.75 80,11.75 80.5,11.25 80.5,7.06 CON3.9
PORTC_7  (via drill 0.35)
  Top 0.2: U4.P45 77.5,26.5 v78,26 | v78,19 78,12.75 78.5,12.25 81.25,12.25 81.83,11.67 CON3.10
  Bottom 0.2: v78,26 v78,19
RST  (via drill 0.35)
  Top 0.2: SW1.4 SW1.3 46.5,55.75 | U4.P14 63.5,34.75 63,34.25 v59.5,34.25 | v59.5,37.25 57.5,37.25 57,37.75 57,40.75 56.5,41.25 47,41.25 46.5,41.75 46.5,55 46.12,55.38 | 46.5,56.5 46.5,55.75 | R10.P$1 46.12,55.38 | 46.12,55.38 46.5,55.75
  Bottom 0.2: v59.5,34.25 v59.5,37.25
RX  (via drill 0.35)
  Top 0.2: U4.P23 65,30.25 63.5,28.75 63.5,26.75 63,26.25 58.5,26.25 56.5,28.25 33.75,28.25 33.25,28.75 33.25,40 32.5,40.75 29,40.75 28.25,40 v27.25,40
  Top 0.3: U$1.3 v16,45.41
  Bottom 0.2: v16,45.41 26.84,45.41 27.25,45 v27.25,40
SWD_CLK  (via drill 0.35)
  Top 0.2: U4.P76 v80,44.5
  Bottom 0.2: v80,44.5 80,40 79.5,39.5 77.25,39.5 76.75,40 76.75,41.5 76,42.25 72.75,42.25 72.25,42.75 72.25,66.75 71,68 31.75,68 31.19,67.44 SWD.1
SWD_IO  (via drill 0.35)
  Top 0.2: v85.25,39.75 U4.P72
  Bottom 0.2: SWD.2 33.73,66.98 34.25,67.5 70.75,67.5 71.75,66.5 71.75,42.5 72.5,41.75 75.75,41.75 76.25,41.25 76.25,39.75 77,39 80.75,39 U4.P72 v85.25,39.75
TX
  Top 0.2: U4.P24 65.25,29.75 64,28.5 64,26.5 63.25,25.75 58.25,25.75 56.25,27.75 31.75,27.75 31,28.5 R9.1

### Text on the board
tPlace: USB | DEBUG | RST | DSP-1 | DSP-2 | DIY-AUDIO | BOOT-1 | PORT-1 | CP-2021 | PORT-0 | DSP-ENGINE | BOOT-0 | LCD | ENCODER | ERROR | LOCK | RUN | PANEL
bPlace: PB13-CLK | PB15-DOUT | PB12-STR | PB14-DIN | PC10-CLK | PC12-DOUT | PD0-STR | PC11-DIN | GND | D+ | D- | VCC | CLK | DIO | GND | 3V3 | PD9 | PD8 | PD15 | PD14 | PB7 | PB6 | PA3 | PA2 | GND | VCC | PD7 | PD5 | PA10 | PA9 | PA8 | PC9 | PC7 | PC6 | GND | VCC | GND | PE8 | PE10 | PE12 | PE14 | VCC | PE7 | PE9 | PE11 | PE13 | PB10-SCL | PB11-SDA | +5V | GND | PB0-ENA | PC5-ENSW | PB1-ENB | GND
tNames: C7 | R4 | R7 | R8 | C18 | C17 | C14 | C8 | TX-PA0 | J2 | C9 | RX-PA1 | C10 | C19 | C12 | U5 | STM32 | C20 | F407Vxx | C13 | C1 | C16 | U4 | C21 | C15 | C23 | C2 | R5 | R6 | J1 | C11 | W28Qxx | R3 | R2 | R1
bNames: VCC | GND | INDONESIA | DIY-TECH ENGINEERING | PC15 | PC14 | PC13